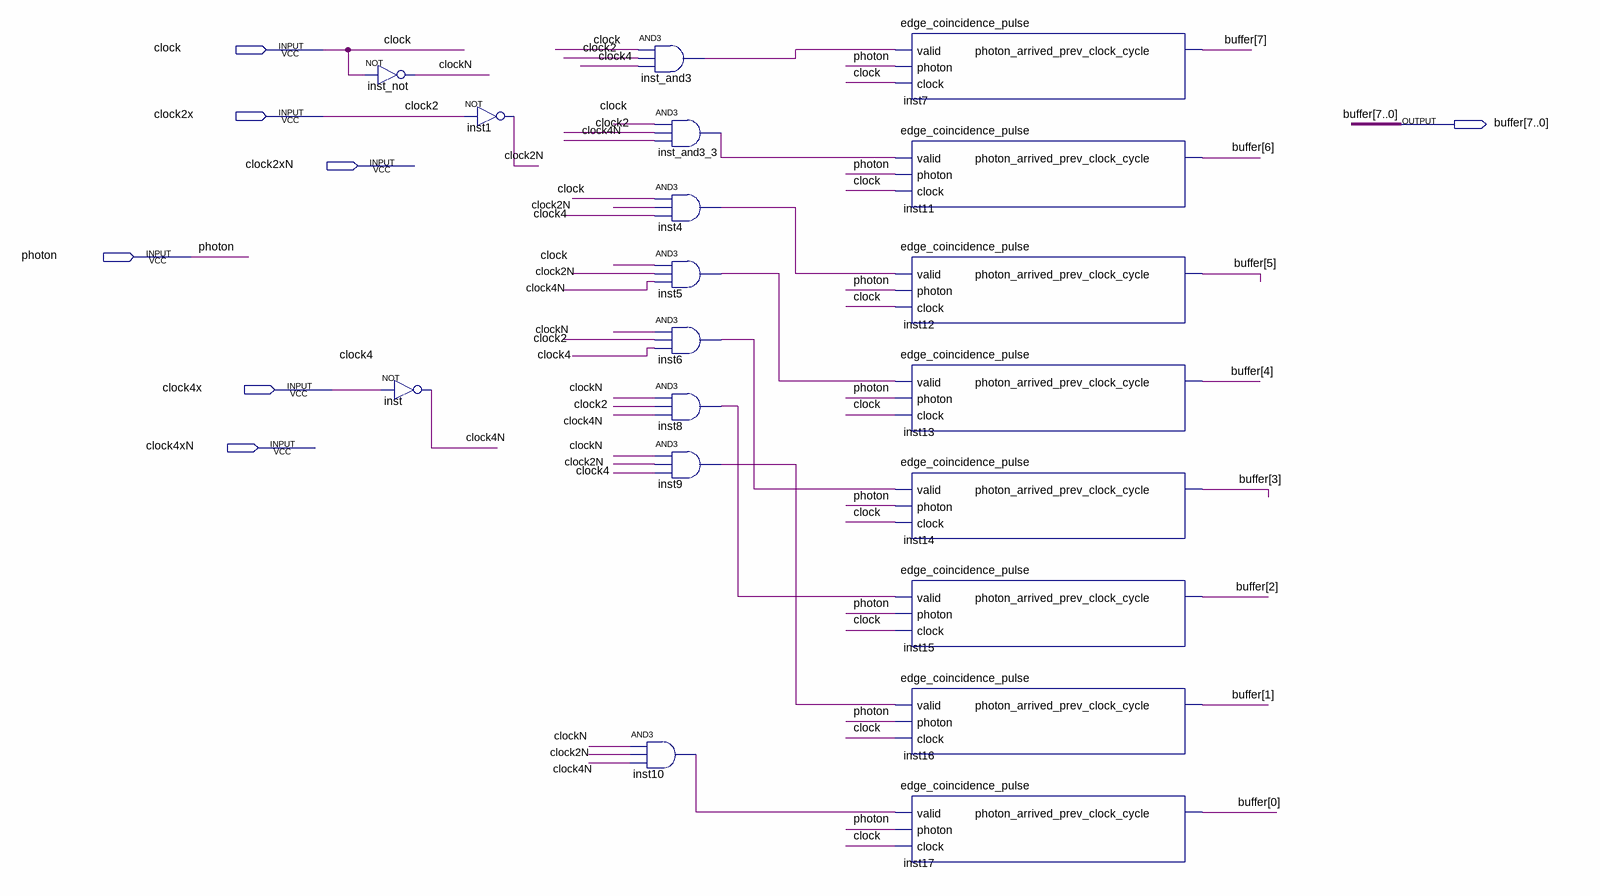
[diagram p0: schematic sheet]
// Quartus schematic my8bindemultiplexer.bdf as structural Verilog: 19 symbols, 7 pins
module my8bindemultiplexer (
  input  clock,
  input  clock2x,
  input  clock2xN,
  input  photon,
  input  clock4x,
  input  clock4xN,
  output [7:0] buffer
);

  wire clock2N, clock4N, clockN, inst4_out, inst5_out, inst6_out, inst8_out, inst9_out, inst10_out,
       inst_and3_3_out, inst_and3_out;

  not inst_not (clockN, clock);
  not inst (clock4N, clock4x);
  not inst1 (clock2N, clock2x);
  and inst_and3 (inst_and3_out, clock, clock2x, clock4x);
  and inst_and3_3 (inst_and3_3_out, clock, clock2x, clock4N);
  and inst4 (inst4_out, clock, clock2N, clock4x);
  and inst5 (inst5_out, clock, clock2N, clock4N);
  and inst6 (inst6_out, clockN, clock2x, clock4x);
  and inst8 (inst8_out, clockN, clock2x, clock4N);
  and inst9 (inst9_out, clockN, clock2N, clock4x);
  and inst10 (inst10_out, clockN, clock2N, clock4N);
  edge_coincidence_pulse inst7 (
    .valid(inst_and3_out), .photon(photon), .clock(clock), .photon_arrived_prev_clock_cycle(buffer[7]));
  edge_coincidence_pulse inst11 (
    .valid(inst_and3_3_out), .photon(photon), .clock(clock), .photon_arrived_prev_clock_cycle(buffer[6]));
  edge_coincidence_pulse inst12 (
    .valid(inst4_out), .photon(photon), .clock(clock), .photon_arrived_prev_clock_cycle(buffer[5]));
  edge_coincidence_pulse inst13 (
    .valid(inst5_out), .photon(photon), .clock(clock), .photon_arrived_prev_clock_cycle(buffer[4]));
  edge_coincidence_pulse inst14 (
    .valid(inst6_out), .photon(photon), .clock(clock), .photon_arrived_prev_clock_cycle(buffer[3]));
  edge_coincidence_pulse inst15 (
    .valid(inst8_out), .photon(photon), .clock(clock), .photon_arrived_prev_clock_cycle(buffer[2]));
  edge_coincidence_pulse inst16 (
    .valid(inst9_out), .photon(photon), .clock(clock), .photon_arrived_prev_clock_cycle(buffer[1]));
  edge_coincidence_pulse inst17 (
    .valid(inst10_out), .photon(photon), .clock(clock), .photon_arrived_prev_clock_cycle(buffer[0]));

  // Other names for the same wires on the sheet: clock2 = clock2x; clock4 = clock4x
endmodule
